# EasyEDA Pro project 2025智能物流搬运_PCB_XAUT_20250927.eprj, schematic Schematic6
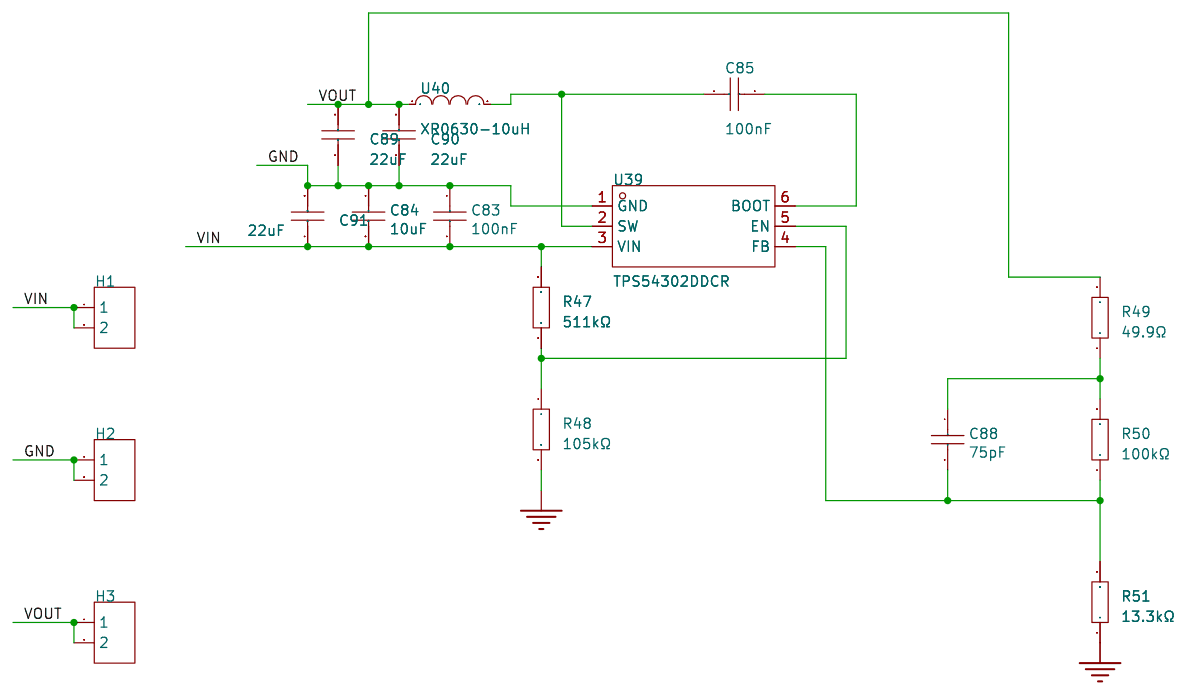
[diagram p8: schematic sheet]

## Parts
C83  100nF  [C0603]
C84  10uF  [C0603]
C85  100nF  [C0603]
C88  75pF  [C0603]
C89  22uF  [C0805]
C90  22uF  [C0805]
C91  22uF  [C0805]
H1  -  [HDR-TH_2P-P2.54-V-F]
H2  -  [HDR-TH_2P-P2.54-V-F]
H3  -  [HDR-TH_2P-P2.54-V-F]
R47  511kΩ  [R0603]
R48  105kΩ  [R0603]
R49  49.9Ω  [R0603]
R50  100kΩ  [R0603]
R51  13.3kΩ  [R0603]
U39  TPS54302DDCR  [SOT-23-6_L2.9-W1.6-P0.95-LS2.8-BL]
U40  XR0630-10uH  [IND-SMD_L7.0-W6.6]

## Library data of the parts
C83-C85 C88 = 100nF: link: https://item.szlcsc.com/362304.html; 3DModel: C0603_L1.6-W0.8-H0.8; Supplier: LCSC; Manufacturer: FH(风华); Manufacturer Part: 0603B104K500NT; Supplier Part: C30926; JLCPCB Part Class: Extended Part
C89-C91 = CL21C200JBANNNC: 容值:20pF;精度:±5%;额定电压:50V;材质(温度系数):C0G;; LCSC Part Name: 20pF ±5% 50V; Supplier Part: C1798; Manufacturer: SAMSUNG(三星); Supplier Footprint: 0805; JLCPCB Part Class: 基础库; Datasheet: https://atta.szlcsc.com/upload/public/pdf/source/20160218/1457707763339.pdf; Supplier: LCSC; Tolerance: ±5%; Voltage Rated: 50V; Temperature Coefficient: C0G
H1-H3 = HDR-F_2.54_1x2P: Supplier Part: C49661; Supplier Footprint: 插件
R47-R51 = 2kΩ: link: https://www.mouser.in/datasheet/2/447/PYu_RT_1_to_0_01_RoHS_L_11-1669912.pdf; Supplier: LCSC; Manufacturer: UNI-ROYAL(厚声); Manufacturer Part: 0603WAF2001T5E; Supplier Part: C22975; JLCPCB Part Class: Basic Part
U39 = TPS54302DDCR: 功能类型:降压型;输出类型:可调;输入电压:4.5V~28V;输出电压:596mV~28V;输出电流(最大值):3A;; Supplier Part: C311983; Manufacturer: TI(德州仪器); Supplier Footprint: TSOT-23-6; JLCPCB Part Class: 扩展库; Datasheet: https://www.ti.com/cn/lit/gpn/tps54302; Supplier: LCSC; Function: 降压型; Output Type: 可调; Input Voltage: 4.5V~28V; Output Voltage: 596mV~28V; Output Current (Max): 3A; Switching Frequency: 400kHz; Operating Temperature: -40℃~+125℃@(TJ); Synchronous Rectification: 是; Number of Outputs: 1; Topology: 降压式; Switch tube (built-in/external): 内置
U40 = XR0630-1R0M_1: LCSC Part Name: XR0630-1R0M; Supplier Part: C9900095446; Supplier Footprint: pl0630_7p0x6p6; JLCPCB Part Class: 扩展库; Supplier: LCSC

## Nets
GND: C83.1 C84.1 C89.1 C90.1 C91.2 H2.1 H2.2 R48.2 R51.1 U39.1(GND)
VIN: C83.2 C84.2 C91.1 H1.1 H1.2 R47.2 U39.3(VIN)
VOUT: C89.2 C90.2 H3.1 H3.2 R49.2 U40.1
$1N435: C85.2 U39.6(BOOT)
$1N436: C88.2 R50.1 R51.2 U39.4(FB)
$1N437: C85.1 U39.2(SW) U40.2
$1N438: C88.1 R49.1 R50.2
$1N442: R47.1 R48.1 U39.5(EN)
